# Altium schematic sheet BatteryEmulator.SchDoc
size A4; SheetNumber: 12; SheetTotal: 13
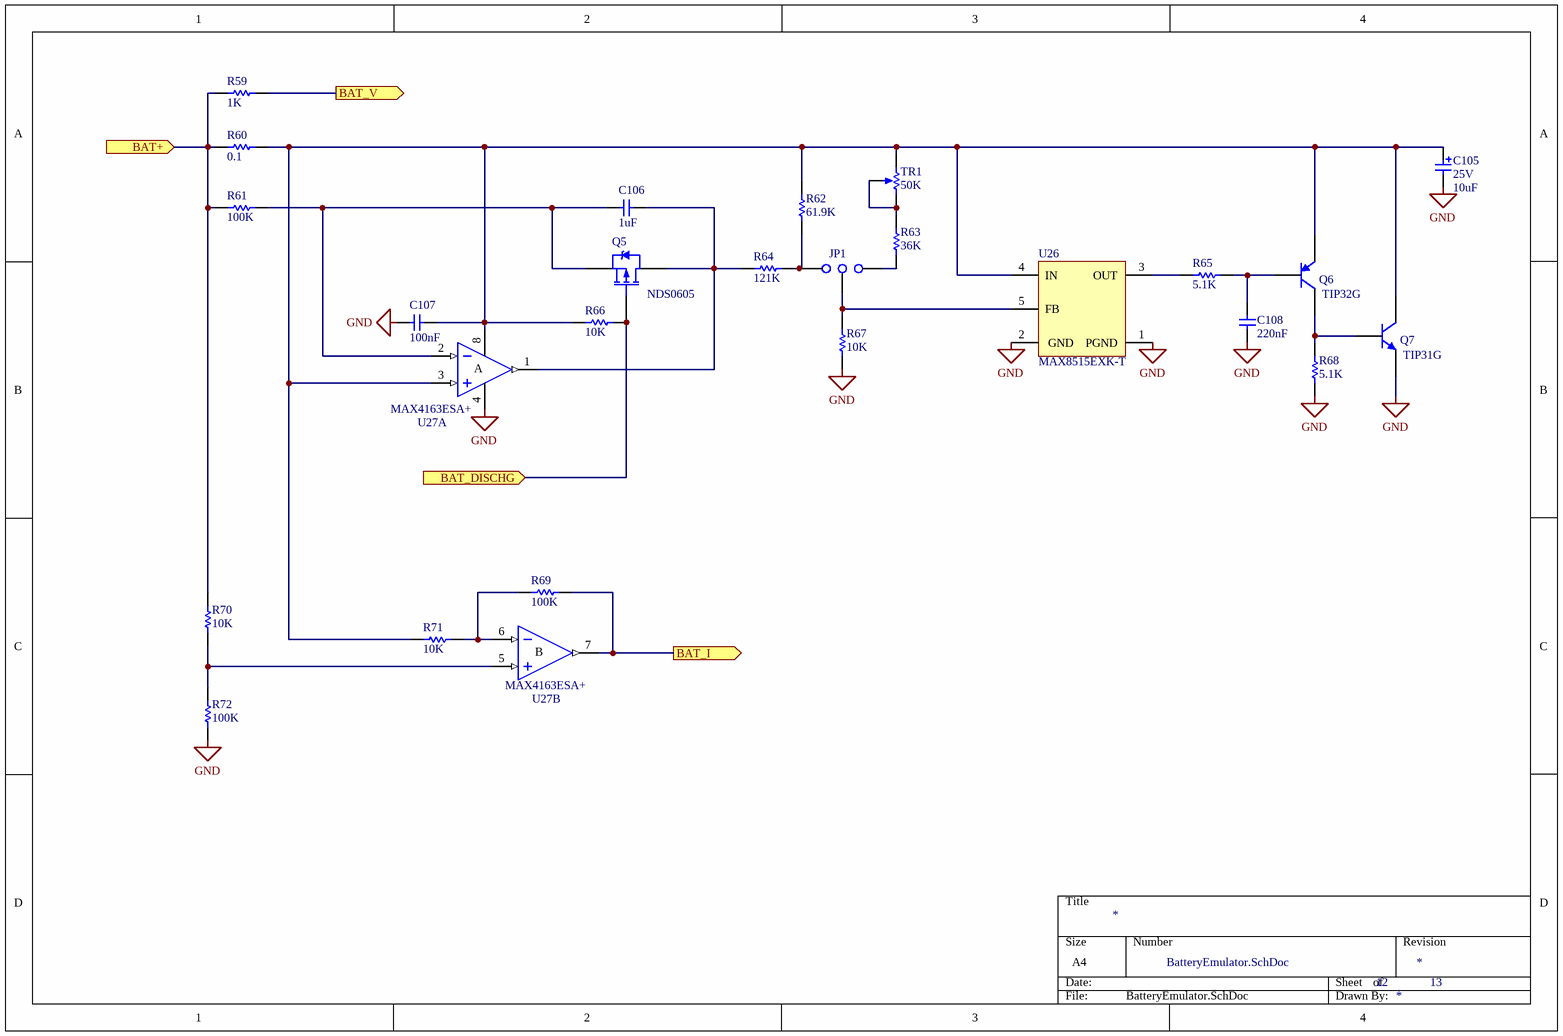
[diagram p0: BatteryEmulator.SchDoc]

## Parts
C105  25V  value 10uF  [Cap Elet SMD 6.3 mm CASE D]
C106  value 1uF  [Cap Polyester 5 mm]  (hidden comment: Cap Polyester)
C107  value 100nF  [0603M-C]  (hidden comment: Cap Ceramic)
C108  value 220nF  [0603M-C]  (hidden comment: Cap Ceramic)
JP1  Jumper 3 pin  [HEADER3]  (value not drawn)
Q5  NDS0605  [SOT23 PMV65XP MOS]
Q6  TIP32G  [TO220_BJT]
Q7  TIP31G  [TO220_BJT]
R59  value 1K  [0603M]  (hidden comment: Resistor)
R60  value 0.1  [1206M]  (hidden comment: Resistor)
R61  value 100K  [0603M]  (hidden comment: Resistor)
R62  value 61.9K  [0603M]  (hidden comment: Resistor)
R63  value 36K  [0603M]  (hidden comment: Resistor)
R64  value 121K  [0603M]  (hidden comment: Resistor)
R65  value 5.1K  [0603M]  (hidden comment: Resistor)
R66  value 10K  [0603M]  (hidden comment: Resistor)
R67  value 10K  [0603M]  (hidden comment: Resistor)
R68  value 5.1K  [0603M]  (hidden comment: Resistor)
R69  value 100K  [0603M]  (hidden comment: Resistor)
R70  value 10K  [0603M]  (hidden comment: Resistor)
R71  value 10K  [0603M]  (hidden comment: Resistor)
R72  value 100K  [0603M]  (hidden comment: Resistor)
TR1  value 50K  [TRIMMER 3296W]  (hidden comment: Giri)
U26  MAX8515EXK-T  [SC70-SOT65P210X110-5N]
U27  MAX4163ESA+  [SOIC127P600-8N]  (parts A,B of 2)

## Ports
BAT+ (in, see 2HE2E_Tester), BAT_DISCHG (in, see 2HE2E_Tester), BAT_I (out, see 2HE2E_Tester), BAT_V (out, see 2HE2E_Tester)

## Nets
GND: C105.2 C107.1 C108.1 Q7.3(E) R67.1 R68.2 R72.1 U26.1(PGND) U26.2(GND) U27.4(V-)
BAT+: R59.1 R60.1 R61.1 R70.2 ; port BAT+
BAT_DISCHG: Q5.1(G) R66.2 ; port BAT_DISCHG
BAT_I: R69.2 U27.7(OUT) ; port BAT_I
BAT_V: R59.2 ; port BAT_V
NetC105_1: C105.1 C107.2 Q6.3(E) Q7.1(C) R60.2 R62.2 R66.1 R71.1 TR1.1(TOP) U26.4(IN) U27.3(IN+) U27.8(V+)
NetC106_1: C106.1 Q5.3(S) R61.2 U27.2(IN-)
NetC106_2: C106.2 Q5.2(D) R64.1 U27.1(OUT)
NetC108_2: C108.2 Q6.2(B) R65.1
NetJP1_1: JP1.1 R62.1 R64.2
NetJP1_2: JP1.2 R67.2 U26.5(FB)
NetJP1_3: JP1.3 R63.1
NetQ6_1: Q6.1(C) Q7.2(B) R68.1
NetR63_2: R63.2 TR1.2(BOT) TR1.3(TAP)
NetR65_2: R65.2 U26.3(OUT)
NetR69_1: R69.1 R71.2 U27.6(IN-)
NetR70_1: R70.1 R72.2 U27.5(IN+)

## Notes on the sheet
- Title
- Size:
- Date:
- A4
- Number:
- Time:
- Revision:
- Sheet
- of
- File:
- (in symbol MAX4163, part A) A
- (in symbol MAX4163, part B) B

## Library data of the parts
C105 = Cap Elettrolitico: Condensatore elettrolitico
C106 = Cap Polyester: Polyester Capacitor
C107 C108 = Cap Ceramic: Ceramic Capacitor
JP1 = Jumper3
Q5 = Transistor PMOS Enhancement: Mosfet canale P Enhancement
Q6 = Transistor PNP: PNP Bipolar Transistor; Published: 8-Jun-2000; LatestRevisionDate: 17-Jul-2002; LatestRevisionNote: Re-released for DXP Platform.; PackageReference: SOT-23B; Publisher: Altium Limited; Code_JEDEC: SOT-23
Q7 = Transistor NPN: NPN Bipolar Transistor
TR1 = Trimmer
U26 = MAX8515: Wide-Input 0.6V Shunt Regulators for Isolated DC-to-DC Converters
U27 = MAX4163: Op Amps UCSP, Micropower, Single-Supply, 10V, Rail-to-Rail I/O